# Altium schematic sheet programming_module.SchDoc: LPC1768
size 298 x 212 mm; Date: 31.05.2016 15:06:24; SheetNumber: 1
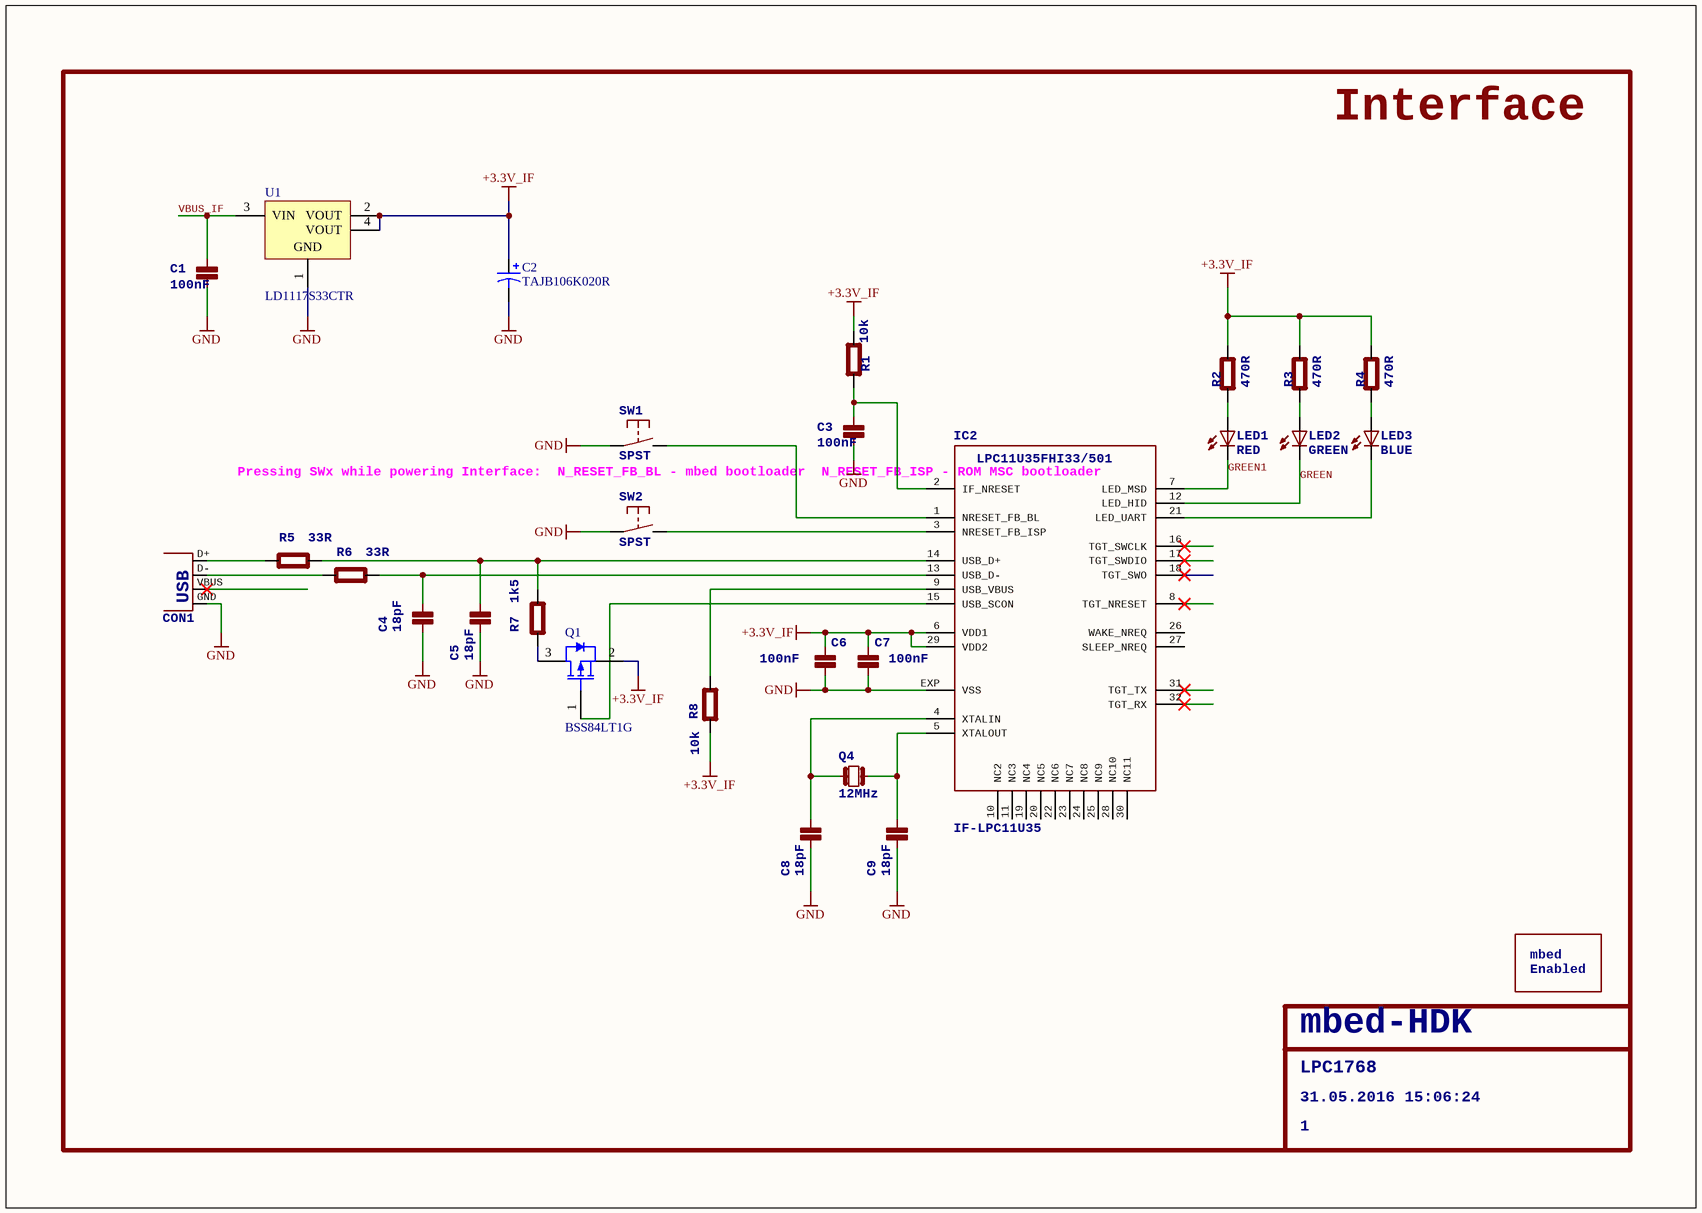
[diagram p0: programming_module.SchDoc]

## Parts
C1  100nF  [0603]
C2  TAJB106K020R  [AVX-CAPC3528_V]
C3  100nF  [0603]
C4  18pF  [0603]
C5  18pF  [0603]
C6  100nF  [0603]
C7  100nF  [0603]
C8  18pF  [0603]
C9  18pF  [0603]
CON1  USB-MB-S  [USB-MB-S]  (value not drawn)
IC2  IF-LPC11U35  [HVQFN33]
LED1  RED  [CHIPLED_0603]
LED2  GREEN  [CHIPLED_0603]
LED3  BLUE  [CHIPLED_0603]
Q1  BSS84LT1G  [ONSC-SOT-23-3-318-08_V]
Q4  12MHz  [HC49UP]
R1  10k  [0603]
R2  470R  [0603]
R3  470R  [0603]
R4  470R  [0603]
R5  33R  [0603]
R6  33R  [0603]
R7  1k5  [0603]
R8  10k  [0603]
SS1  MBED-ENABLED-LOGOMEDIUM  [MBED-ENABLED-LOGO-500X500-MIL]  (value not drawn)
SW1  SPST  [DTSM-32S-B]
SW2  SPST  [DTSM-32S-B]
U1  LD1117S33CTR  [SOT-223_N]

## Nets
+3.3V_IF: C2.1 C6.1(P$1) C7.1(P$1) IC2.6(VDD1) IC2.29(VDD2) Q1.2(S) R1.2(P$2) R2.1(P$1) R3.1(P$1) R4.1(P$1) R8.2(P$2) U1.2(VOUT) U1.4(VOUT)
GND: C1.2(P$2) C2.2 C3.2(P$2) C4.2(P$2) C5.2(P$2) C6.2(P$2) C7.2(P$2) C8.2(P$2) C9.2(P$2) CON1.GND IC2.EXP(VSS) SW1.P$1(P) SW2.P$1(P) U1.1(GND)
GREEN: IC2.12(LED_HID) LED2.C
GREEN1: IC2.7(LED_MSD) LED1.C
VBUS_IF: C1.1(P$1) U1.3(VIN)
NetC3_1: C3.1(P$1) IC2.2(IF_NRESET) R1.1(P$1)
NetC4_1: C4.1(P$1) IC2.13(USB_D-) R6.2(P$2)
NetC5_1: C5.1(P$1) IC2.14(USB_D+) R5.2(P$2) R7.2(P$2)
NetC8_1: C8.1(P$1) IC2.4(XTALIN) Q4.1
NetC9_1: C9.1(P$1) IC2.5(XTALOUT) Q4.2
NetCON1_D+: CON1.D+ R5.1(P$1)
NetCON1_D-: CON1.D- R6.1(P$1)
NetIC2_1: IC2.1(NRESET_FB_BL) SW1.P$2(S)
NetIC2_3: IC2.3(NRESET_FB_ISP) SW2.P$2(S)
NetIC2_9: IC2.9(USB_VBUS) R8.1(P$1)
NetIC2_15: IC2.15(USB_SCON) Q1.1(G)
NetIC2_21: IC2.21(LED_UART) LED3.C
NetLED1_A: LED1.A R2.2(P$2)
NetLED2_A: LED2.A R3.2(P$2)
NetLED3_A: LED3.A R4.2(P$2)
NetQ1_3: Q1.3(D) R7.1(P$1)

Not connected (* = marked no-connect by the designer): CON1 VBUS*; IC2 8(TGT_NRESET)* 10(NC2) 11(NC3) 16(TGT_SWCLK)* 17(TGT_SWDIO)* 18(TGT_SWO)* 19(NC4) 20(NC5) 22(NC6) 23(NC7) 24(NC8) 25(NC9) 26(WAKE_NREQ) 27(SLEEP_NREQ) 28(NC10) 30(NC11) 31(TGT_TX)* 32(TGT_RX)*

## Notes on the sheet
- Interface
- (near IC2) Pressing SWx while powering Interface:
  N_RESET_FB_BL - mbed bootloader
  N_RESET_FB_ISP - ROM MSC bootloader
- LPC1768
- mbed-HDK
- 31.05.2016 15:06:24
- 1

## Library data of the parts
C1 C3-C9 = C0603
C2 = CMP-0279-00001-1: Capacitor, Tantalum, 10uF 10% 20V MCCT-B (3528); Manufacturer: AVX; Polarity: Polarized; PartNumber: TAJB106K020R; PackageDescription: 2-Pin SMT Capacitor, 3.5 x 2.8 mm Body; ComponentLink1URL: http://www.avx.com/; PackageReference: CAPC3528; ComponentLink2Description: Datasheet; Capacitance: 10uF; Technology: Tantalum; ComponentLink2URL: http://www.avx.com/docs/Catalogs/taj.pdf; Tolerance: 10%; ComponentLink1Description: Manufacturer URL; Rated Voltage: 20V; DatasheetVersion: Jun-13; Mounting Technology: Surface Mount
CON1 = USB-MB-S: USB Connectors; USB: USB
LED1-LED3 = LED0603
Q1 = CMP-1058-00762-1: Power MOSFET Single P-Channel, -50 V, 10 Ohm, 3-Pin SOT-23, Pb-Free, Tape and Reel; Manufacturer: On Semiconductor; Ciss Typ (pF): 36; ID Max (A): 0.13; Channel Polarity: P Channel; VGS(th) Max (V): 2; VGS Max (V): 20; V(BR)DSS Min (V): 50; Crss Typ (pF): 6.5; PD Max (W): 0.225; Coss Typ (pF): 17; Configuration: Single; Mounting Technology: Surface Mount; ComponentLink3URL: http://www.onsemi.cn/pub_link/Collateral/318-08.PDF; ComponentLink1Description: Manufacturer URL; Package Type: SOT-23-3; ComponentLink2URL: http://www.onsemi.com/pub_link/Collateral/BSS84LT1-D.PDF; RoHS: Pb-Free; Packing: Tape and Reel; ComponentLink1URL: http://www.onsemi.com/; PackageVersion: Rev. AP, 11/2009; PackageReference: SOT-23-3-318-08; PackageDescription: 3-Pin Small Outline Transistor, Body 2.92 x 1.3 mm, Pitch 0.95 mm; DatasheetVersion: Rev. 8; ComponentLink3Description: Package Specification; PartNumber: BSS84LT1G; ComponentLink2Description: Datasheet
Q4 = Q_HC49UP
R1-R8 = R0603
U1 = CMP-0244-00307-1: Fixed Low Drop Positive Voltage Regulator, 3.3V, 4-Pin SOT-223, Tape and Reel; ComponentLink1URL: http://www.st.com; PackageVersion: 2010; ComponentLink1Description: Manufacturer URL; DatasheetVersion: 1/11/2011; ComponentLink2URL: http://www.st.com/internet/com/TECHNICAL_RESOURCES/TECHNICAL_LITERATURE/DATASHEET/CD00000544.pdf; PackageReference: SOT-223; ComponentLink2Description: Datasheet; PackageDescription: 4-Pin SOT-223 Package, 6.5 x 3.5 mm Body, 2.3 mm Pitch, 7 mm Lead Span
IC2 = IF-LPC11U35: LPC11U35FHI33/501: LPC11U35FHI33/501
SS1 = MBED-ENABLED-LOGOMEDIUM: mbed: mbed; Enabled: Enabled